# Altium schematic sheet SourceFollower_TSFP-4-1_Modular.SchDoc
size A
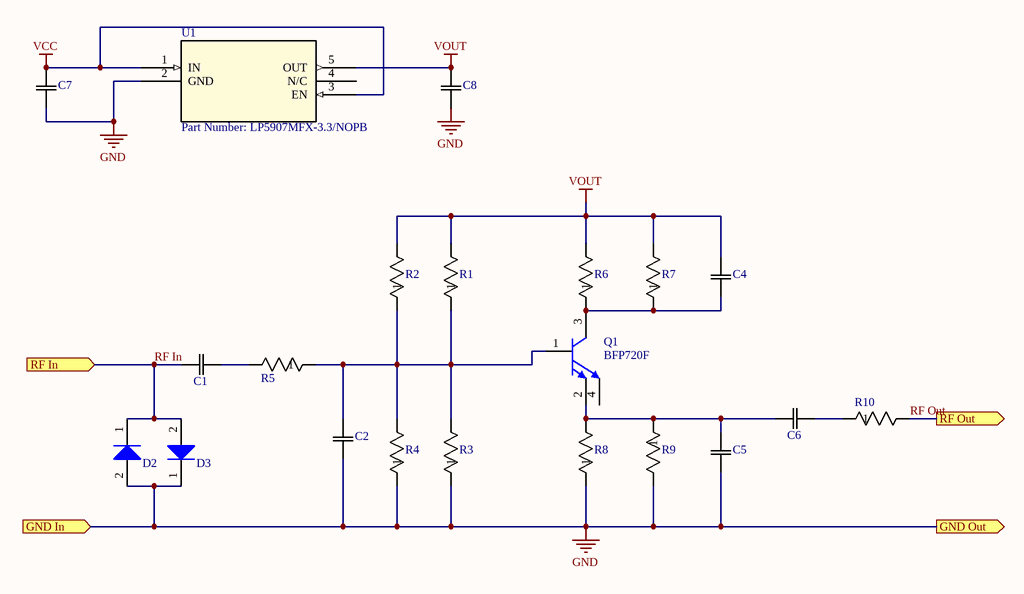
[diagram p0: SourceFollower_TSFP-4-1_Modular.SchDoc]

## Parts
C1  Part Number: C0201C270J3GACTU  [C0201]  (value not drawn)
C2  Part Number: C0201C270J3GACTU  [C0201]  (value not drawn)
C4  Part Number: C0201C270J3GACTU  [C0201]  (value not drawn)
C5  Part Number: C0201C270J3GACTU  [C0201]  (value not drawn)
C6  Part Number: C0201C270J3GACTU  [C0201]  (value not drawn)
C7  Part Number: CC0402KRX7R6BB104  [YAG_CC0402]  (value not drawn)
C8  Part Number: CC0402KRX7R6BB104  [YAG_CC0402]  (value not drawn)
D2  BAT15-03W  [INF-SOD323_V]  (value not drawn)
D3  BAT15-03W  [INF-SOD323_V]  (value not drawn)
Q1  BFP720F  [INF-TSFP-4-1_V]
R1  Part Number: RC0201FR-0718KL  [RES_RC0201_P6XP3]  (value not drawn)
R2  Part Number: RC0201FR-0718KL  [RES_RC0201_P6XP3]  (value not drawn)
R3  Part Number: RC0201FR-0718KL  [RES_RC0201_P6XP3]  (value not drawn)
R4  Part Number: RC0201FR-0718KL  [RES_RC0201_P6XP3]  (value not drawn)
R5  Part Number: RC0201FR-0718KL  [RES_RC0201_P6XP3]  (value not drawn)
R6  Part Number: RC0201FR-0718KL  [RES_RC0201_P6XP3]  (value not drawn)
R7  Part Number: RC0201FR-0718KL  [RES_RC0201_P6XP3]  (value not drawn)
R8  Part Number: RC0201FR-0718KL  [RES_RC0201_P6XP3]  (value not drawn)
R9  Part Number: RC0201FR-0718KL  [RES_RC0201_P6XP3]  (value not drawn)
R10  Part Number: RC0201FR-0718KL  [RES_RC0201_P6XP3]  (value not drawn)
U1  Part Number: LP5907MFX-3.3/NOPB  [DBV5]

## Ports
GND In (in), GND Out (out), RF In (in), RF Out (out)

## Nets
GND: C2.1 C5.1 C7.1 C8.1 D2.2(A) D3.1(K) R3.1 R4.1 R8.1 R9.2 U1.2(GND) ; port GND In, port GND Out
VCC: C7.2 U1.1(IN) U1.3(EN)
VOUT: C4.2 C8.2 R1.2 R2.2 R6.2 R7.2 U1.5(OUT)
RF In: C1.1 D2.1(K) D3.2(A) ; port RF In
RF Out: R10.2 ; port RF Out
NetC1_2: C1.2 R5.2
NetC2_2: C2.2 Q1.1(B) R1.1 R2.1 R3.2 R4.2 R5.1
NetC4_1: C4.1 Q1.3(C) R6.1 R7.1
NetC5_2: C5.2 C6.2 Q1.2(E) R8.2 R9.1
NetC6_1: C6.1 R10.1

Not connected (* = marked no-connect by the designer): Q1 4(E); U1 4(N/C)

## Library data of the parts
C1 C2 C4-C6 = C0201C270J3GACTU: No Description Available; Vendor: Kemet; Built_By: EMA_UL_Team; Type: DEV; Manufacturer_Part_Number: C0201C270J3GACTU; Copyright: Copyright (C) 2018 Accelerated Designs. All rights reserved; RefDes: RefDes; Value: Value
C7 C8 = CC0402KRX7R6BB10: No Description Available; Vendor: Yageo; Built_By: EMA_UL_Team; Type: DEV; Manufacturer_Part_Number: CC0402KRX7R6BB104; Copyright: Copyright (C) 2018 Accelerated Designs. All rights reserved; RefDes: RefDes; Value: Value
D2 D3 = BAT15-03W: Single Silicon Schottky Diode, 110 mA IF Max, SOD32, Green; Manufacturer: Infineon; CT (typ): 0.26 pF; Green: yes; Group: RF Mixer; IF (max): 110 mA; VF (typ): 0.23 V; VR (max): 4 V; DatasheetVersion: Jun-2011; PackageReference: SOD323; PackageDescription: 2-Pin Small Outline Diode Package, 1.25 x 1.7 mm Body; Supplier 1: Mouser; Supplier Part Number 1: N/A; Configuration: Single; Mounting Technology: Surface Mount; PartNumber: BAT15-03W; ComponentLink1Description: Manufacturer URL; ComponentLink1URL: http://www.infineon.com/; ComponentLink2Description: Datasheet; ComponentLink2URL: http://www.infineon.com/dgdl/bat15series.pdf?folderId=db3a304314dca3890114ff6812070b44&fileId=db3a304314dca3890114ff6b74ca0b48&location=en.Products.RF.RF_Mixer___Detector_Schottky_Diodes.DATASHEET.bat15series.pdf; ComponentLink3Description: Package Specification; ComponentLink3URL: http://www.infineon.com/dgdl/SOD323-Package_Overview.pdf?folderId=db3a30431936bc4b011952aab84f3bbe&fileId=db3a30431936bc4b011952beed653be3
Q1 = BFP720F: SiGe:C Heterojunction Wideband RF Bipolar Transistor, 4 V VCEO, 20 mA IC, 26 dB Gmax, TSFP-4-1, Green; Manufacturer: Infineon; Gmax (typ): 26 dB; Green: yes; Group: Ultra low noise SiGe; IC (max): 20 mA; NFmin (typ): 0.5 dB; Ptot (max): 80mW; VCEO (max): 4 V; DatasheetVersion: Rev. 1.0; PackageReference: TSFP-4-1; PackageDescription: 4-Pin Thin Small Flat Package, 0.8 x 1.4 mm Body, 0.5 mm Pitch; Halogen-free: yes; Mounting Technology: Surface Mount; PartNumber: BFP720F; ComponentLink1Description: Manufacturer URL; ComponentLink1URL: http://www.infineon.com/; ComponentLink2Description: Datasheet; ComponentLink2URL: http://www.infineon.com/dgdl/bfp720f.pdf?folderId=db3a30431400ef68011425b291f205c5&fileId=db3a30431ddc9372011e2673bdbf4727&location=en.Products.RF.RF_Transistors_.Ultra_Low_Noise_SiGe_C_Transistors_for_use_up_to_12_GHz.DATASHEET.bfp720f.pdf; ComponentLink3Description: Package Specification; ComponentLink3URL: http://www.infineon.com/dgdl/TSFP-4-1%2C-2-Package_Overview.pdf?folderId=db3a30431936bc4b011953b7d203683d&fileId=db3a30431936bc4b011953c249663734
R1-R10 = RC0201FR-0718KL: No Description Available; Vendor: Yageo; Built_By: EMA_Anthony; Copyright: Copyright (C) 2018 Accelerated Designs. All rights reserved; Manufacturer_Part_Number: RC0201FR-0718KL; RefDes: RefDes; Type: DEV; Value: Value
U1 = LP5907MFX-3.3/NO: No Description Available; Vendor: Texas Instruments; Built_By: EMA_UL_Team; Manufacturer_Part_Number: LP5907MFX-3.3/NOPB; Copyright: Copyright (C) 2018 Accelerated Designs. All rights reserved; RefDes: RefDes; Type: DEV; Value: Value